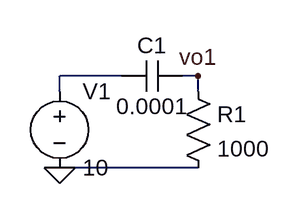
[diagram p0: schematic High_Pass.asc]
High_Pass.asc, the LTspice schematic file:
Version 4
SHEET 1 880 680
WIRE 48 96 -16 96
WIRE 128 96 112 96
WIRE -16 112 -16 96
WIRE 128 112 128 96
WIRE 128 192 -16 192
FLAG -16 192 0
FLAG 128 96 vo1
SYMBOL cap 112 80 R90
WINDOW 0 0 32 VBottom 2
WINDOW 3 32 32 VTop 2
SYMATTR InstName C1
SYMATTR Value 0.0001
SYMBOL res 112 96 R0
SYMATTR InstName R1
SYMATTR Value 1000
SYMBOL voltage -16 96 R0
WINDOW 123 0 0 Left 2
WINDOW 39 0 0 Left 2
SYMATTR InstName V1
SYMATTR Value 10

The netlist it stands for:
* High_Pass.asc
C1 vo1 N001 0.0001
R1 vo1 0 1000
V1 N001 0 10
.backanno
.end